# EAGLE design core (EAGLE 9.6.2)
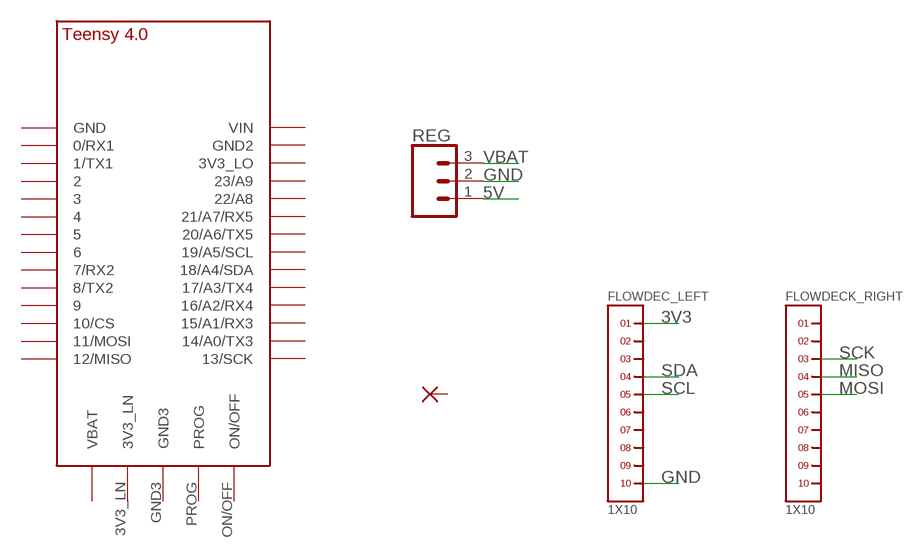
[diagram p0: schematic, sheet 1]

## Parts
FLOWDEC_LEFT  1X10  [1X10]
FLOWDECK_RIGHT  1X10  [1X10]
PAD18  SMD2  [SMD1,27-2,54]
REG  CONN_031X03_NO_SILK  [1X03_NO_SILK]
U$1  TEENSY_4.0  [TEENSY_4.0]

## Nets
3V3: FLOWDEC_LEFT.1
5V: REG.1
GND: FLOWDEC_LEFT.10 REG.2
MISO: FLOWDECK_RIGHT.4
MOSI: FLOWDECK_RIGHT.5
SCK: FLOWDECK_RIGHT.3
SCL: FLOWDEC_LEFT.5
SDA: FLOWDEC_LEFT.4
VBAT: REG.3
Unconnected: FLOWDEC_LEFT.2 FLOWDEC_LEFT.3 FLOWDEC_LEFT.6 FLOWDEC_LEFT.7 FLOWDEC_LEFT.8 FLOWDEC_LEFT.9 FLOWDECK_RIGHT.1 FLOWDECK_RIGHT.2 FLOWDECK_RIGHT.6 FLOWDECK_RIGHT.7 FLOWDECK_RIGHT.8 FLOWDECK_RIGHT.9 FLOWDECK_RIGHT.10 PAD18.1(P) U$1.0/RX(0/RX1) U$1.1/TX(1/TX1) U$1.2 U$1.3/CANTX U$1.3V3_LN U$1.3V3_LO U$1.4/CANRX U$1.5 U$1.6 U$1.7(7/RX2) U$1.8(8/TX2) U$1.9/CS U$1.10/CS U$1.11/MOSI U$1.12/MISO U$1.13/SCK U$1.14/A0(14/A0/TX3) U$1.15/A1(15/A1/RX3) U$1.16/A2(16/A2/RX4) U$1.17/A3(17/A3/TX4) U$1.18/A4/SDA U$1.19/A5/SCL U$1.20/A6(20/A6/TX5) U$1.21/A7(21/A7/RX5) U$1.22/A8 U$1.23/A9 U$1.GND U$1.GND2 U$1.GND3 U$1.ON/OFF U$1.PROG U$1.VBAT\(VBAT) U$1.VIN

## Library data of the parts
FLOWDEC_LEFT FLOWDECK_RIGHT = headers(2mm):1X10
PAD18 = wirepad:SMD2: SMD PAD
REG = SparkFun-Connectors:CONN_03: Multi connection point. Often used as Generic Header-pin footprint for 0.1 inch spaced/style header connections On any of the 0.1 inch spaced packages, you can populate with these: Break Away Headers - Straight <https://www.sparkfun.com/products/116> (PRT-00116) Break Away Male Headers - Right Angle <https://www.sparkfun.com/products/553> (PRT-00553) Female Headers <https://www.sparkfun.com/products/115> (PRT-00115) Break Away Headers - Machine Pin <https://www.sparkfun.com/products/117> (PRT-00117) Break Away Female Headers - Swiss Machine Pin <https://www.sparkfun.com/products/743> (PRT-00743) Stackable Header - 3 Pin (Female, 0.1") <https://www.sparkfun.com/products/13875> (PRT-13875) For SCREWTERMINALS and SPRING TERMINALS visit here: Screw Terimnals on SparkFun.com <https://www.sparkfun.com/search/results?term=Screw+Terminals> (5mm/3.5mm/2.54mm spacing) This device is also useful as a general connection point to wire up your design to another part of your project. Our various solder wires solder well into these plated through hole pads. Hook-Up Wire - Assortment (Stranded, 22 AWG) <https://www.sparkfun.com/products/11375> (PRT-11375) Hook-Up Wire - Assortment (Solid Core, 22 AWG) <https://www.sparkfun.com/products/11367> (PRT-11367) View the entire wire category on our website here <https://www.sparkfun.com/categories/141> Special notes: Molex polarized connector foot print use with SKU : PRT-08232 with associated crimp pins and housings.
U$1 = TEENSY 4.0:TEENSY_4.0

## Board
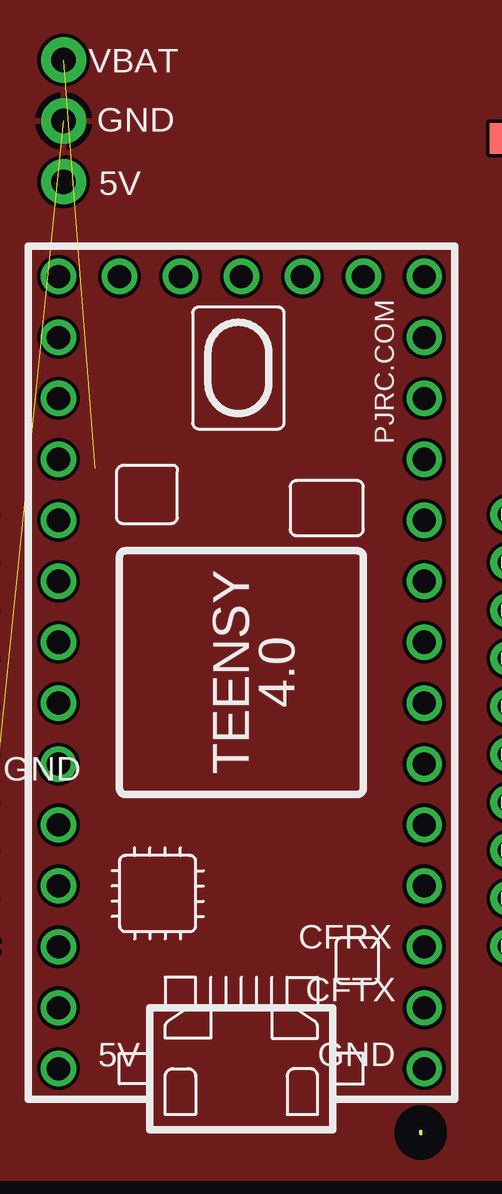
[diagram p1: board, top side]
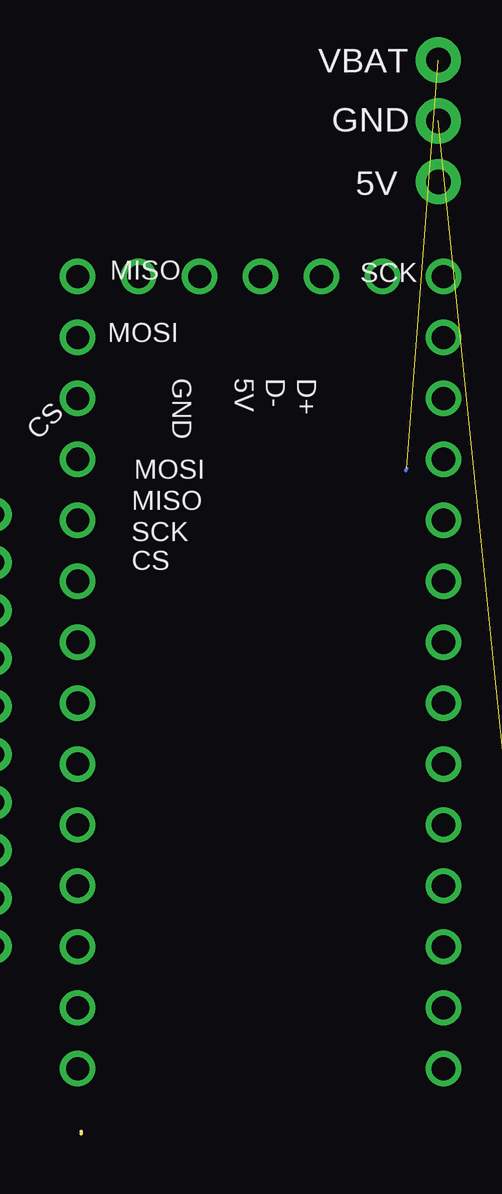
[diagram p2: board, bottom side, seen from below]

Size 0 x 0.1 mm. Coordinates in mm from the lower left corner, seen from the top.
Outline: 0,0 0,0.1
Copper layers (1*16): Top 0.035mm / dielectric 1.5mm / Bottom 0.035mm
Design rules "default": minimum track width 6mil, minimum drill 0.35mm, track to track 6mil, track to pad 6mil, pad to pad 6mil, via to via 6mil, smd to smd 6mil, copper to edge 40mil, drill to drill 6mil, minimum pad ring 10mil, minimum via ring 8mil, stop-mask expansion 4mil, vias tented up to drill 0mil, thermal gap 10mil

### Footprints (pad centres in the part's own frame; a part is rotated, then mirrored left to right if it is on the bottom)
1X10 = drill 0.8 pad 1.422: 1 -9,0; 2 -7,0; 3 -5,0; 4 -3,0; 5 -1,0; 6 1,0; 7 3,0; 8 5,0; 9 7,0; 10 9,0
SMD1,27-2,54 = smd 1.27 x 2.54: 1 0,0
1X03_NO_SILK = drill 1.016 pad 1.88: 1 0,0; 2 2.54,0; 3 5.08,0
TEENSY_4.0 = drill 0.965: 0/RX -13.97,-7.62; 1/TX -11.43,-7.62; 2 -8.89,-7.62; 3/CANTX -6.35,-7.62; 3V3_LN 16.51,-2.54; 3V3_LO -11.43,7.62; 4/CANRX -3.81,-7.62; 5 -1.27,-7.62; 6 1.27,-7.62; 7 3.81,-7.62; 8 6.35,-7.62; 9/CS 8.89,-7.62; 10/CS 11.43,-7.62; 11/MOSI 13.97,-7.62; 12/MISO 16.51,-7.62; 13/SCK 16.51,7.62; 14/A0 13.97,7.62; 15/A1 11.43,7.62; 16/A2 8.89,7.62; 17/A3 6.35,7.62; 18/A4/SDA 3.81,7.62; 19/A5/SCL 1.27,7.62; 20/A6 -1.27,7.62; 21/A7 -3.81,7.62; 22/A8 -6.35,7.62; 23/A9 -8.89,7.62; GND -16.51,-7.62; GND2 -13.97,7.62; GND3 16.51,0; ON/OFF 16.51,5.08; PROG 16.51,2.54; VBAT\ 16.51,-5.08; VIN -16.51,7.62

### Placement (x,y rotation side)
FLOWDEC_LEFT  -18.4,16.8 270 top  (outside the outline)
FLOWDECK_RIGHT  3.6,16.8 270 top  (outside the outline)
PAD18  4.14,41.48 90 top  (outside the outline)
REG  -14.89,39.67 90 top  (outside the outline)
U$1  -7.48,19.22 90 top

### Tracks (layer width: path | path; a pad name or v marks a point on that pad's centre or on a via)
5V
  Top 0.152: -14.78,40.58 -14.78,39.81 REG.1
GND  (1 unrouted)
  pour Top: -25.3,53.7 11.1,53.7 11.1,-1.9 -25.3,-1.9
VBAT  (1 unrouted)
  Bottom 0.152: -13.58,27.73 -13.53,27.64

### Text on the board
tNames: VBAT | GND | 5V | GND | CFRX | CFTX | 5V | GND
bNames: VBAT | GND | 5V | SCK | MISO | MOSI | D+ | D- | 5V | GND | CS | MOSI | MISO | SCK | CS